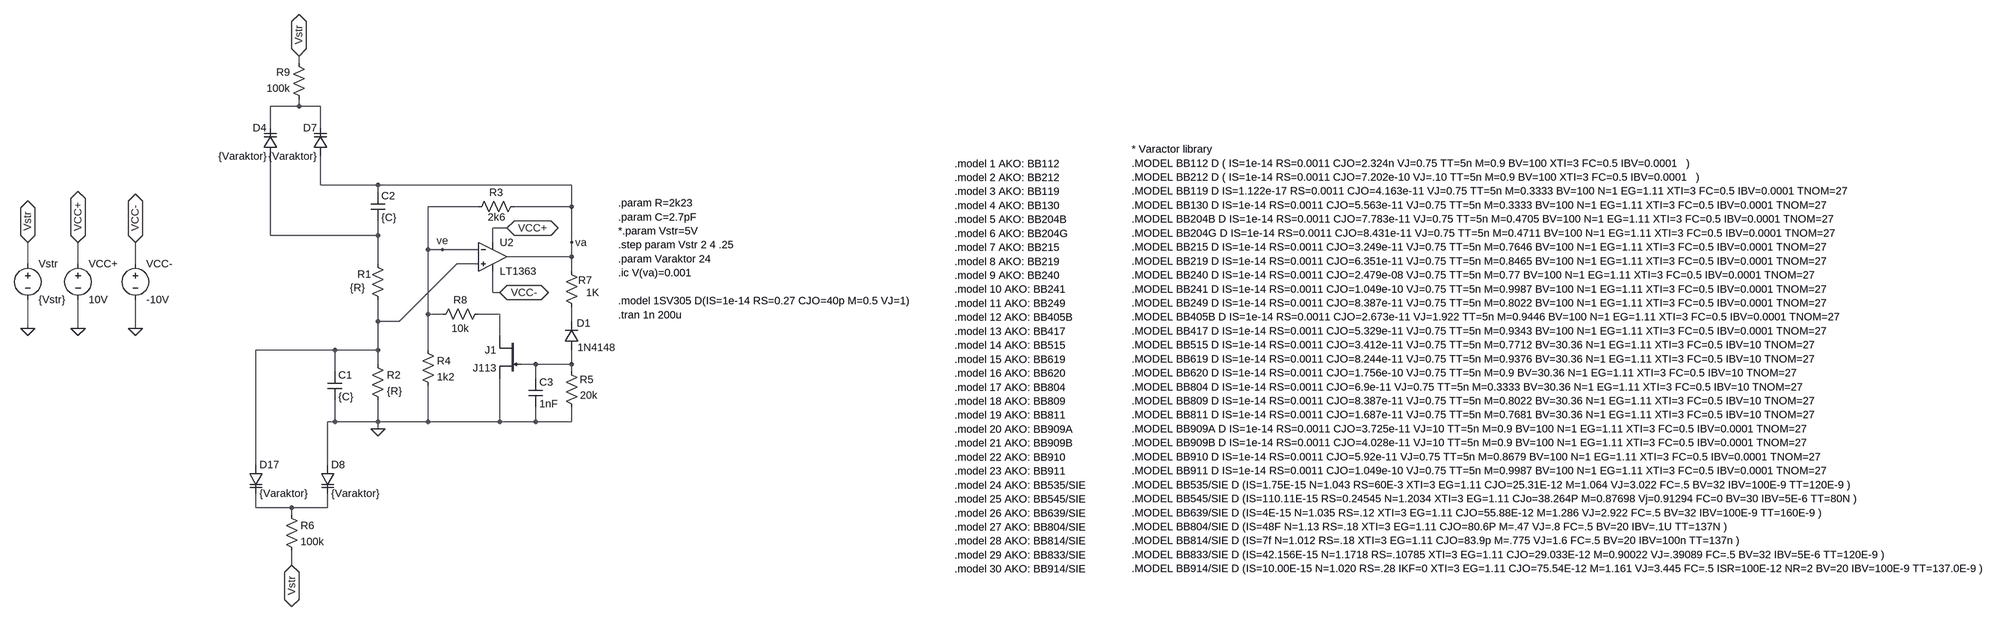
[diagram p0: schematic Wien-LT.asc]
Wien-LT.asc, the LTspice schematic file:
Version 4
SHEET 1 3984 680
WIRE 16 -2976 16 -2992
WIRE 16 -2880 16 -2896
WIRE 16 -2880 -48 -2880
WIRE 64 -2880 16 -2880
WIRE -48 -2832 -48 -2880
WIRE 64 -2832 64 -2880
WIRE 64 -2704 64 -2768
WIRE 192 -2704 64 -2704
WIRE 624 -2704 192 -2704
WIRE 192 -2688 192 -2704
WIRE 416 -2656 304 -2656
WIRE 624 -2656 624 -2704
WIRE 624 -2656 496 -2656
WIRE 480 -2608 448 -2608
WIRE -48 -2592 -48 -2768
WIRE 192 -2592 192 -2624
WIRE 192 -2592 -48 -2592
WIRE 448 -2576 448 -2608
WIRE 624 -2576 624 -2656
WIRE 304 -2560 304 -2656
WIRE 336 -2560 304 -2560
WIRE 416 -2560 336 -2560
WIRE 624 -2544 624 -2576
WIRE 624 -2544 480 -2544
WIRE -672 -2528 -672 -2576
WIRE -560 -2528 -560 -2576
WIRE -432 -2528 -432 -2576
WIRE 192 -2528 192 -2592
WIRE 416 -2528 368 -2528
WIRE 624 -2512 624 -2544
WIRE 448 -2464 448 -2512
WIRE 464 -2464 448 -2464
WIRE 304 -2416 304 -2560
WIRE 336 -2416 304 -2416
WIRE 464 -2416 416 -2416
WIRE 192 -2400 192 -2448
WIRE 240 -2400 368 -2528
WIRE 240 -2400 192 -2400
WIRE 624 -2400 624 -2432
WIRE -672 -2384 -672 -2448
WIRE -560 -2384 -560 -2448
WIRE -432 -2384 -432 -2448
WIRE 464 -2368 464 -2416
WIRE 96 -2336 -80 -2336
WIRE 192 -2336 192 -2400
WIRE 192 -2336 96 -2336
WIRE 304 -2336 304 -2416
WIRE 192 -2304 192 -2336
WIRE 544 -2304 512 -2304
WIRE 624 -2304 624 -2336
WIRE 624 -2304 544 -2304
WIRE 96 -2288 96 -2336
WIRE 624 -2288 624 -2304
WIRE 544 -2272 544 -2304
WIRE 96 -2176 96 -2224
WIRE 96 -2176 80 -2176
WIRE 192 -2176 192 -2224
WIRE 192 -2176 96 -2176
WIRE 304 -2176 304 -2256
WIRE 304 -2176 192 -2176
WIRE 464 -2176 464 -2272
WIRE 464 -2176 304 -2176
WIRE 544 -2176 544 -2208
WIRE 544 -2176 464 -2176
WIRE 624 -2176 624 -2208
WIRE 624 -2176 544 -2176
WIRE 192 -2160 192 -2176
WIRE -80 -2080 -80 -2336
WIRE 80 -2080 80 -2176
WIRE -80 -1984 -80 -2016
WIRE 0 -1984 -80 -1984
WIRE 80 -1984 80 -2016
WIRE 80 -1984 0 -1984
WIRE 0 -1968 0 -1984
WIRE 0 -1856 0 -1888
FLAG 192 -2160 0
FLAG -560 -2576 VCC+
IOPIN -560 -2576 BiDir
FLAG -432 -2576 VCC-
IOPIN -432 -2576 BiDir
FLAG 480 -2608 VCC+
IOPIN 480 -2608 BiDir
FLAG 464 -2464 VCC-
IOPIN 464 -2464 BiDir
FLAG -432 -2384 0
FLAG -560 -2384 0
FLAG -672 -2384 0
FLAG 16 -2992 Vstr
IOPIN 16 -2992 BiDir
FLAG 0 -1856 Vstr
IOPIN 0 -1856 BiDir
FLAG -672 -2576 Vstr
IOPIN -672 -2576 BiDir
FLAG 336 -2560 ve
FLAG 624 -2576 va
SYMBOL cap 80 -2288 R0
SYMATTR InstName C1
SYMATTR Value {C}
SYMBOL cap 176 -2688 R0
SYMATTR InstName C2
SYMATTR Value {C}
SYMBOL res 176 -2320 R0
SYMATTR InstName R2
SYMATTR Value {R}
SYMBOL res 288 -2352 R0
SYMATTR InstName R4
SYMATTR Value 1k2
SYMBOL res 432 -2432 R90
WINDOW 0 0 56 VBottom 2
WINDOW 3 32 56 VTop 2
SYMATTR InstName R8
SYMATTR Value 10k
SYMBOL res 640 -2192 R180
WINDOW 0 -33 78 Left 2
WINDOW 3 -42 43 Left 2
SYMATTR InstName R5
SYMATTR Value 20k
SYMBOL res 640 -2416 R180
WINDOW 0 -30 76 Left 2
WINDOW 3 -46 48 Left 2
SYMATTR InstName R7
SYMATTR Value 1K
SYMBOL res 400 -2640 R270
WINDOW 0 32 56 VTop 2
WINDOW 3 8 57 VBottom 2
SYMATTR InstName R3
SYMATTR Value 2k6
SYMBOL res 176 -2544 R0
WINDOW 0 -30 39 Left 2
WINDOW 3 -46 69 Left 2
SYMATTR InstName R1
SYMATTR Value {R}
SYMBOL res 32 -2880 R180
WINDOW 0 36 76 Left 2
WINDOW 3 36 40 Left 2
SYMATTR InstName R9
SYMATTR Value 100k
SYMBOL res -16 -1984 R0
SYMATTR InstName R6
SYMATTR Value 100k
SYMBOL diode 640 -2336 R180
WINDOW 0 -26 60 Left 2
WINDOW 3 -82 6 Left 2
SYMATTR InstName D1
SYMATTR Value 1N4148
SYMBOL cap 528 -2272 R0
SYMATTR InstName C3
SYMATTR Value 1nF
SYMBOL voltage -432 -2544 R0
SYMATTR InstName VCC-
SYMATTR Value -10V
SYMBOL voltage -560 -2544 R0
SYMATTR InstName VCC+
SYMATTR Value 10V
SYMBOL voltage -672 -2544 R0
SYMATTR InstName Vstr
SYMATTR Value {Vstr}
SYMBOL LT1363 448 -2608 R0
SYMATTR InstName U2
SYMBOL varactor -32 -2768 R180
WINDOW 0 24 64 Left 2
WINDOW 3 24 0 Left 2
SYMATTR InstName D4
SYMATTR Value {Varaktor}
SYMBOL njf 512 -2368 M0
SYMATTR InstName J1
SYMATTR Value J113
SYMBOL varactor 80 -2768 R180
WINDOW 0 24 64 Left 2
WINDOW 3 24 0 Left 2
SYMATTR InstName D7
SYMATTR Value {Varaktor}
SYMBOL varactor 64 -2080 R0
SYMATTR InstName D8
SYMATTR Value {Varaktor}
SYMBOL varactor -96 -2080 R0
SYMATTR InstName D17
SYMATTR Value {Varaktor}
TEXT 728 -2664 Left 2 !.param R=2k23\n.param C=2.7pF\n*.param Vstr=5V\n.step param Vstr 2 4 .25\n.param Varaktor 24\n.ic V(va)=0.001\n \n.model 1SV305 D(IS=1e-14 RS=0.27 CJO=40p M=0.5 VJ=1)\n.tran 1n 200u
TEXT 1496 -2752 Left 2 !.model 1 AKO: BB112\n.model 2 AKO: BB212\n.model 3 AKO: BB119\n.model 4 AKO: BB130\n.model 5 AKO: BB204B\n.model 6 AKO: BB204G\n.model 7 AKO: BB215\n.model 8 AKO: BB219\n.model 9 AKO: BB240\n.model 10 AKO: BB241\n.model 11 AKO: BB249\n.model 12 AKO: BB405B\n.model 13 AKO: BB417\n.model 14 AKO: BB515\n.model 15 AKO: BB619\n.model 16 AKO: BB620\n.model 17 AKO: BB804\n.model 18 AKO: BB809\n.model 19 AKO: BB811\n.model 20 AKO: BB909A\n.model 21 AKO: BB909B\n.model 22 AKO: BB910\n.model 23 AKO: BB911\n.model 24 AKO: BB535/SIE\n.model 25 AKO: BB545/SIE\n.model 26 AKO: BB639/SIE\n.model 27 AKO: BB804/SIE\n.model 28 AKO: BB814/SIE\n.model 29 AKO: BB833/SIE\n.model 30 AKO: BB914/SIE
TEXT 1936 -2784 Left 2 !* Varactor library\n.MODEL BB112 D ( IS=1e-14 RS=0.0011 CJO=2.324n VJ=0.75 TT=5n M=0.9 BV=100 XTI=3 FC=0.5 IBV=0.0001   )\n.MODEL BB212 D ( IS=1e-14 RS=0.0011 CJO=7.202e-10 VJ=.10 TT=5n M=0.9 BV=100 XTI=3 FC=0.5 IBV=0.0001   )\n.MODEL BB119 D IS=1.122e-17 RS=0.0011 CJO=4.163e-11 VJ=0.75 TT=5n M=0.3333 BV=100 N=1 EG=1.11 XTI=3 FC=0.5 IBV=0.0001 TNOM=27  \n.MODEL BB130 D IS=1e-14 RS=0.0011 CJO=5.563e-11 VJ=0.75 TT=5n M=0.3333 BV=100 N=1 EG=1.11 XTI=3 FC=0.5 IBV=0.0001 TNOM=27  \n.MODEL BB204B D IS=1e-14 RS=0.0011 CJO=7.783e-11 VJ=0.75 TT=5n M=0.4705 BV=100 N=1 EG=1.11 XTI=3 FC=0.5 IBV=0.0001 TNOM=27  \n.MODEL BB204G D IS=1e-14 RS=0.0011 CJO=8.431e-11 VJ=0.75 TT=5n M=0.4711 BV=100 N=1 EG=1.11 XTI=3 FC=0.5 IBV=0.0001 TNOM=27  \n.MODEL BB215 D IS=1e-14 RS=0.0011 CJO=3.249e-11 VJ=0.75 TT=5n M=0.7646 BV=100 N=1 EG=1.11 XTI=3 FC=0.5 IBV=0.0001 TNOM=27  \n.MODEL BB219 D IS=1e-14 RS=0.0011 CJO=6.351e-11 VJ=0.75 TT=5n M=0.8465 BV=100 N=1 EG=1.11 XTI=3 FC=0.5 IBV=0.0001 TNOM=27  \n.MODEL BB240 D IS=1e-14 RS=0.0011 CJO=2.479e-08 VJ=0.75 TT=5n M=0.77 BV=100 N=1 EG=1.11 XTI=3 FC=0.5 IBV=0.0001 TNOM=27  \n.MODEL BB241 D IS=1e-14 RS=0.0011 CJO=1.049e-10 VJ=0.75 TT=5n M=0.9987 BV=100 N=1 EG=1.11 XTI=3 FC=0.5 IBV=0.0001 TNOM=27  \n.MODEL BB249 D IS=1e-14 RS=0.0011 CJO=8.387e-11 VJ=0.75 TT=5n M=0.8022 BV=100 N=1 EG=1.11 XTI=3 FC=0.5 IBV=0.0001 TNOM=27  \n.MODEL BB405B D IS=1e-14 RS=0.0011 CJO=2.673e-11 VJ=1.922 TT=5n M=0.9446 BV=100 N=1 EG=1.11 XTI=3 FC=0.5 IBV=0.0001 TNOM=27  \n.MODEL BB417 D IS=1e-14 RS=0.0011 CJO=5.329e-11 VJ=0.75 TT=5n M=0.9343 BV=100 N=1 EG=1.11 XTI=3 FC=0.5 IBV=0.0001 TNOM=27  \n.MODEL BB515 D IS=1e-14 RS=0.0011 CJO=3.412e-11 VJ=0.75 TT=5n M=0.7712 BV=30.36 N=1 EG=1.11 XTI=3 FC=0.5 IBV=10 TNOM=27  \n.MODEL BB619 D IS=1e-14 RS=0.0011 CJO=8.244e-11 VJ=0.75 TT=5n M=0.9376 BV=30.36 N=1 EG=1.11 XTI=3 FC=0.5 IBV=10 TNOM=27  \n.MODEL BB620 D IS=1e-14 RS=0.0011 CJO=1.756e-10 VJ=0.75 TT=5n M=0.9 BV=30.36 N=1 EG=1.11 XTI=3 FC=0.5 IBV=10 TNOM=27  \n.MODEL BB804 D IS=1e-14 RS=0.0011 CJO=6.9e-11 VJ=0.75 TT=5n M=0.3333 BV=30.36 N=1 EG=1.11 XTI=3 FC=0.5 IBV=10 TNOM=27  \n.MODEL BB809 D IS=1e-14 RS=0.0011 CJO=8.387e-11 VJ=0.75 TT=5n M=0.8022 BV=30.36 N=1 EG=1.11 XTI=3 FC=0.5 IBV=10 TNOM=27  \n.MODEL BB811 D IS=1e-14 RS=0.0011 CJO=1.687e-11 VJ=0.75 TT=5n M=0.7681 BV=30.36 N=1 EG=1.11 XTI=3 FC=0.5 IBV=10 TNOM=27  \n.MODEL BB909A D IS=1e-14 RS=0.0011 CJO=3.725e-11 VJ=10 TT=5n M=0.9 BV=100 N=1 EG=1.11 XTI=3 FC=0.5 IBV=0.0001 TNOM=27  \n.MODEL BB909B D IS=1e-14 RS=0.0011 CJO=4.028e-11 VJ=10 TT=5n M=0.9 BV=100 N=1 EG=1.11 XTI=3 FC=0.5 IBV=0.0001 TNOM=27  \n.MODEL BB910 D IS=1e-14 RS=0.0011 CJO=5.92e-11 VJ=0.75 TT=5n M=0.8679 BV=100 N=1 EG=1.11 XTI=3 FC=0.5 IBV=0.0001 TNOM=27  \n.MODEL BB911 D IS=1e-14 RS=0.0011 CJO=1.049e-10 VJ=0.75 TT=5n M=0.9987 BV=100 N=1 EG=1.11 XTI=3 FC=0.5 IBV=0.0001 TNOM=27  \n.MODEL BB535/SIE D (IS=1.75E-15 N=1.043 RS=60E-3 XTI=3 EG=1.11 CJO=25.31E-12 M=1.064 VJ=3.022 FC=.5 BV=32 IBV=100E-9 TT=120E-9 )\n.MODEL BB545/SIE D (IS=110.11E-15 RS=0.24545 N=1.2034 XTI=3 EG=1.11 CJo=38.264P M=0.87698 Vj=0.91294 FC=0 BV=30 IBV=5E-6 TT=80N )\n.MODEL BB639/SIE D (IS=4E-15 N=1.035 RS=.12 XTI=3 EG=1.11 CJO=55.88E-12 M=1.286 VJ=2.922 FC=.5 BV=32 IBV=100E-9 TT=160E-9 )\n.MODEL BB804/SIE D (IS=48F N=1.13 RS=.18 XTI=3 EG=1.11 CJO=80.6P M=.47 VJ=.8 FC=.5 BV=20 IBV=.1U TT=137N )\n.MODEL BB814/SIE D (IS=7f N=1.012 RS=.18 XTI=3 EG=1.11 CJO=83.9p M=.775 VJ=1.6 FC=.5 BV=20 IBV=100n TT=137n )\n.MODEL BB833/SIE D (IS=42.156E-15 N=1.1718 RS=.10785 XTI=3 EG=1.11 CJO=29.033E-12 M=0.90022 VJ=.39089 FC=.5 BV=32 IBV=5E-6 TT=120E-9 )\n.MODEL BB914/SIE D (IS=10.00E-15 N=1.020 RS=.28 IKF=0 XTI=3 EG=1.11 CJO=75.54E-12 M=1.161 VJ=3.445 FC=.5 ISR=100E-12 NR=2 BV=20 IBV=100E-9 TT=137.0E-9 )

The netlist it stands for:
* Wien-LT.asc
C1 N003 0 {C}
C2 va N002 {C}
R2 N003 0 {R}
R4 ve 0 1k2
R8 N004 ve 10k
R5 0 N006 20k
R7 N005 va 1K
R3 ve va 2k6
R1 N002 N003 {R}
R9 N001 Vstr 100k
R6 N007 Vstr 100k
D1 N006 N005 1N4148
C3 N006 0 1nF
VCC- VCC- 0 -10V
VCC+ VCC+ 0 10V
Vstr Vstr 0 {Vstr}
XU2 N003 ve VCC+ VCC- va LT1363  ; pins In+ In- V+ V- OUT
D4 N002 N001 {Varaktor}
J1 N004 N006 0 J113
D7 va N001 {Varaktor}
D8 0 N007 {Varaktor}
D17 N003 N007 {Varaktor}
.model D D
.lib standard.dio
.model NJF NJF
.model PJF PJF
.lib standard.jft
.param R=2k23
.param C=2.7pF
*.param Vstr=5V
.step param Vstr 2 4 .25
.param Varaktor 24
.ic V(va)=0.001
.model 1SV305 D(IS=1e-14 RS=0.27 CJO=40p M=0.5 VJ=1)
.tran 1n 200u
.model 1 AKO: BB112
.model 2 AKO: BB212
.model 3 AKO: BB119
.model 4 AKO: BB130
.model 5 AKO: BB204B
.model 6 AKO: BB204G
.model 7 AKO: BB215
.model 8 AKO: BB219
.model 9 AKO: BB240
.model 10 AKO: BB241
.model 11 AKO: BB249
.model 12 AKO: BB405B
.model 13 AKO: BB417
.model 14 AKO: BB515
.model 15 AKO: BB619
.model 16 AKO: BB620
.model 17 AKO: BB804
.model 18 AKO: BB809
.model 19 AKO: BB811
.model 20 AKO: BB909A
.model 21 AKO: BB909B
.model 22 AKO: BB910
.model 23 AKO: BB911
.model 24 AKO: BB535/SIE
.model 25 AKO: BB545/SIE
.model 26 AKO: BB639/SIE
.model 27 AKO: BB804/SIE
.model 28 AKO: BB814/SIE
.model 29 AKO: BB833/SIE
.model 30 AKO: BB914/SIE
* Varactor library
.MODEL BB112 D ( IS=1e-14 RS=0.0011 CJO=2.324n VJ=0.75 TT=5n M=0.9 BV=100 XTI=3 FC=0.5 IBV=0.0001   )
.MODEL BB212 D ( IS=1e-14 RS=0.0011 CJO=7.202e-10 VJ=.10 TT=5n M=0.9 BV=100 XTI=3 FC=0.5 IBV=0.0001   )
.MODEL BB119 D IS=1.122e-17 RS=0.0011 CJO=4.163e-11 VJ=0.75 TT=5n M=0.3333 BV=100 N=1 EG=1.11 XTI=3 FC=0.5 IBV=0.0001 TNOM=27
.MODEL BB130 D IS=1e-14 RS=0.0011 CJO=5.563e-11 VJ=0.75 TT=5n M=0.3333 BV=100 N=1 EG=1.11 XTI=3 FC=0.5 IBV=0.0001 TNOM=27
.MODEL BB204B D IS=1e-14 RS=0.0011 CJO=7.783e-11 VJ=0.75 TT=5n M=0.4705 BV=100 N=1 EG=1.11 XTI=3 FC=0.5 IBV=0.0001 TNOM=27
.MODEL BB204G D IS=1e-14 RS=0.0011 CJO=8.431e-11 VJ=0.75 TT=5n M=0.4711 BV=100 N=1 EG=1.11 XTI=3 FC=0.5 IBV=0.0001 TNOM=27
.MODEL BB215 D IS=1e-14 RS=0.0011 CJO=3.249e-11 VJ=0.75 TT=5n M=0.7646 BV=100 N=1 EG=1.11 XTI=3 FC=0.5 IBV=0.0001 TNOM=27
.MODEL BB219 D IS=1e-14 RS=0.0011 CJO=6.351e-11 VJ=0.75 TT=5n M=0.8465 BV=100 N=1 EG=1.11 XTI=3 FC=0.5 IBV=0.0001 TNOM=27
.MODEL BB240 D IS=1e-14 RS=0.0011 CJO=2.479e-08 VJ=0.75 TT=5n M=0.77 BV=100 N=1 EG=1.11 XTI=3 FC=0.5 IBV=0.0001 TNOM=27
.MODEL BB241 D IS=1e-14 RS=0.0011 CJO=1.049e-10 VJ=0.75 TT=5n M=0.9987 BV=100 N=1 EG=1.11 XTI=3 FC=0.5 IBV=0.0001 TNOM=27
.MODEL BB249 D IS=1e-14 RS=0.0011 CJO=8.387e-11 VJ=0.75 TT=5n M=0.8022 BV=100 N=1 EG=1.11 XTI=3 FC=0.5 IBV=0.0001 TNOM=27
.MODEL BB405B D IS=1e-14 RS=0.0011 CJO=2.673e-11 VJ=1.922 TT=5n M=0.9446 BV=100 N=1 EG=1.11 XTI=3 FC=0.5 IBV=0.0001 TNOM=27
.MODEL BB417 D IS=1e-14 RS=0.0011 CJO=5.329e-11 VJ=0.75 TT=5n M=0.9343 BV=100 N=1 EG=1.11 XTI=3 FC=0.5 IBV=0.0001 TNOM=27
.MODEL BB515 D IS=1e-14 RS=0.0011 CJO=3.412e-11 VJ=0.75 TT=5n M=0.7712 BV=30.36 N=1 EG=1.11 XTI=3 FC=0.5 IBV=10 TNOM=27
.MODEL BB619 D IS=1e-14 RS=0.0011 CJO=8.244e-11 VJ=0.75 TT=5n M=0.9376 BV=30.36 N=1 EG=1.11 XTI=3 FC=0.5 IBV=10 TNOM=27
.MODEL BB620 D IS=1e-14 RS=0.0011 CJO=1.756e-10 VJ=0.75 TT=5n M=0.9 BV=30.36 N=1 EG=1.11 XTI=3 FC=0.5 IBV=10 TNOM=27
.MODEL BB804 D IS=1e-14 RS=0.0011 CJO=6.9e-11 VJ=0.75 TT=5n M=0.3333 BV=30.36 N=1 EG=1.11 XTI=3 FC=0.5 IBV=10 TNOM=27
.MODEL BB809 D IS=1e-14 RS=0.0011 CJO=8.387e-11 VJ=0.75 TT=5n M=0.8022 BV=30.36 N=1 EG=1.11 XTI=3 FC=0.5 IBV=10 TNOM=27
.MODEL BB811 D IS=1e-14 RS=0.0011 CJO=1.687e-11 VJ=0.75 TT=5n M=0.7681 BV=30.36 N=1 EG=1.11 XTI=3 FC=0.5 IBV=10 TNOM=27
.MODEL BB909A D IS=1e-14 RS=0.0011 CJO=3.725e-11 VJ=10 TT=5n M=0.9 BV=100 N=1 EG=1.11 XTI=3 FC=0.5 IBV=0.0001 TNOM=27
.MODEL BB909B D IS=1e-14 RS=0.0011 CJO=4.028e-11 VJ=10 TT=5n M=0.9 BV=100 N=1 EG=1.11 XTI=3 FC=0.5 IBV=0.0001 TNOM=27
.MODEL BB910 D IS=1e-14 RS=0.0011 CJO=5.92e-11 VJ=0.75 TT=5n M=0.8679 BV=100 N=1 EG=1.11 XTI=3 FC=0.5 IBV=0.0001 TNOM=27
.MODEL BB911 D IS=1e-14 RS=0.0011 CJO=1.049e-10 VJ=0.75 TT=5n M=0.9987 BV=100 N=1 EG=1.11 XTI=3 FC=0.5 IBV=0.0001 TNOM=27
.MODEL BB535/SIE D (IS=1.75E-15 N=1.043 RS=60E-3 XTI=3 EG=1.11 CJO=25.31E-12 M=1.064 VJ=3.022 FC=.5 BV=32 IBV=100E-9 TT=120E-9 )
.MODEL BB545/SIE D (IS=110.11E-15 RS=0.24545 N=1.2034 XTI=3 EG=1.11 CJo=38.264P M=0.87698 Vj=0.91294 FC=0 BV=30 IBV=5E-6 TT=80N )
.MODEL BB639/SIE D (IS=4E-15 N=1.035 RS=.12 XTI=3 EG=1.11 CJO=55.88E-12 M=1.286 VJ=2.922 FC=.5 BV=32 IBV=100E-9 TT=160E-9 )
.MODEL BB804/SIE D (IS=48F N=1.13 RS=.18 XTI=3 EG=1.11 CJO=80.6P M=.47 VJ=.8 FC=.5 BV=20 IBV=.1U TT=137N )
.MODEL BB814/SIE D (IS=7f N=1.012 RS=.18 XTI=3 EG=1.11 CJO=83.9p M=.775 VJ=1.6 FC=.5 BV=20 IBV=100n TT=137n )
.MODEL BB833/SIE D (IS=42.156E-15 N=1.1718 RS=.10785 XTI=3 EG=1.11 CJO=29.033E-12 M=0.90022 VJ=.39089 FC=.5 BV=32 IBV=5E-6 TT=120E-9 )
.MODEL BB914/SIE D (IS=10.00E-15 N=1.020 RS=.28 IKF=0 XTI=3 EG=1.11 CJO=75.54E-12 M=1.161 VJ=3.445 FC=.5 ISR=100E-12 NR=2 BV=20 IBV=100E-9 TT=137.0E-9 )
.lib LT1363.sub
.backanno
.end